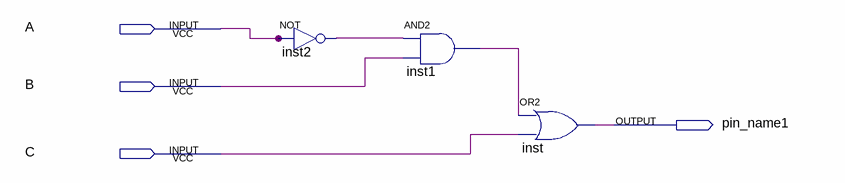
[diagram p0: schematic sheet]
// Quartus schematic Tutorial.bdf as structural Verilog: 3 symbols, 4 pins
module Tutorial (
  input  A,
  input  B,
  input  C,
  output pin_name1
);

  wire inst1_out, inst2_out;

  not inst2 (inst2_out, A);
  and inst1 (inst1_out, inst2_out, B);
  or inst (pin_name1, inst1_out, C);
endmodule
